# EAGLE design CCDebugger-TagConnect (EAGLE 6.5.0)
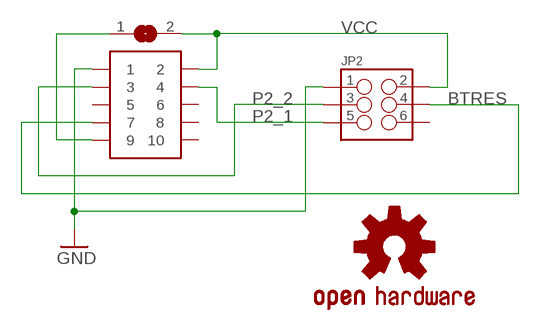
[diagram p0: schematic, sheet 1]

## Parts
JP2  M03X2  [2X3-SHROUDED]
LOGO1  OSHW-LOGOS  [OSHW-LOGO-S]
VCC  SJ  [SJ]
X1  CONN_5-2-FTSH-V  [FTSH-105-DV]

## Nets
BTRES: JP2.4 X1.7
GND: JP2.1 X1.1
N$6: VCC.1 X1.9
P2_1: JP2.5 X1.4
P2_2: JP2.3 X1.3
VCC: JP2.2 VCC.2 X1.2
Unconnected: JP2.6 X1.5 X1.6 X1.8 X1.10

## Library data of the parts
JP2 = SparkFun-Connectors:M03X2: 2x3 .1" header. Shrouded, with keying- CONN-10681 SMT- CONN-11415 Pogo pins- HW-11044; PROD_ID: CONN-10681
LOGO1 = SparkFun-Aesthetics:OSHW-LOGO: Open Source Hardware Logo This logo indicates the piece of hardware it is found on incorporates a OSHW license and/or adheres to the definition of open source hardware found here: http://freedomdefined.org/OSHW
VCC = jumper:SJ: SMD solder JUMPER
X1 = pel_misc:CONN_5-2

## Board
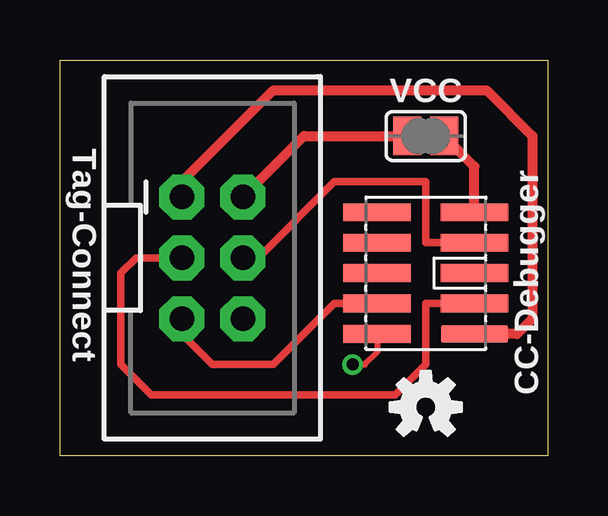
[diagram p1: board, top side]
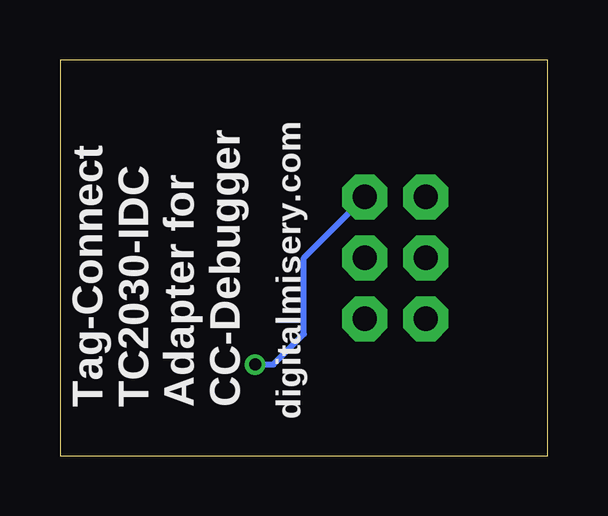
[diagram p2: board, bottom side, seen from below]

Size 20.32 x 16.51 mm. Coordinates in mm from the lower left corner, seen from the top.
Outline: 0,0 0,16.51 20.32,16.51 20.32,0 0,0
Copper layers (1*16): Top 0.0356mm / dielectric 1.5011mm / Bottom 0.0356mm
Design rules "LaenPCBOrder": minimum track width 6mil, minimum drill 13mil, track to track 6mil, track to pad 6mil, pad to pad 6mil, via to via 6mil, smd to smd 6mil, copper to edge 15mil, drill to drill 6mil, minimum pad ring 7mil, minimum via ring 7mil, stop-mask expansion 3mil, vias tented up to drill 0mil, thermal gap 10mil

### Footprints (pad centres in the part's own frame; a part is rotated, then mirrored left to right if it is on the bottom)
2X3-SHROUDED = drill 1.016 pad 1.88 octagon: 1 -1.27,2.54; 2 1.27,2.54; 3 -1.27,0; 4 1.27,0; 5 -1.27,-2.54; 6 1.27,-2.54
SJ = smd 1.168 x 1.6: 1 -0.762,0; 2 0.762,0
FTSH-105-DV = smd 0.74 x 2.8: 1 -2.54,-2.03; 2 -2.54,2.03; 3 -1.27,-2.03; 4 -1.27,2.03; 5 0,-2.03; 6 0,2.03; 7 1.27,-2.03; 8 1.27,2.03; 9 2.54,-2.03; 10 2.54,2.03

### Placement (x,y rotation side)
JP2  6.35,8.26 0 top
LOGO1  15.24,2.03 0 top
VCC  15.24,13.34 180 top
X1  15.24,7.62 90 top

### Tracks (layer width: path | path; a pad name or v marks a point on that pad's centre or on a via)
BTRES
  Top 0.305: JP2.4 8.26,8.26 11.43,11.43 15.24,11.43 15.24,8.89 X1.7
GND
  Top 0.406: X1.1 19.05,5.08 19.68,5.71 19.68,13.34 17.78,15.24 8.89,15.24 5.08,11.43 JP2.1
N$6
  Top 0.406: X1.9 17.27,12.07 VCC.1
P2_1
  Top 0.305: JP2.5 5.08,5.08 6.35,3.81 8.89,3.81 11.43,6.35 X1.4
P2_2
  Top 0.305: X1.3 15.24,6.35 15.24,3.81 13.97,2.54 3.81,2.54 2.54,3.81 2.54,7.62 3.17,8.26 JP2.3
VCC  (via drill 0.5)
  Top 0.254: X1.2 13.21,4.32 12.7,3.81 v12.19,3.81
  Top 0.406: JP2.2 10.16,13.34 VCC.2
  Bottom 0.254: v12.19,3.81 11.43,3.81 10.16,5.08 10.16,8.26 JP2.2

### Text on the board
tPlace: Tag-Connect | CC-Debugger
bPlace: digitalmisery.com | Tag-Connect / TC2030-IDC / Adapter for / CC-Debugger